# EAGLE board button-wall (EAGLE 9.4.2), part 1 of 3
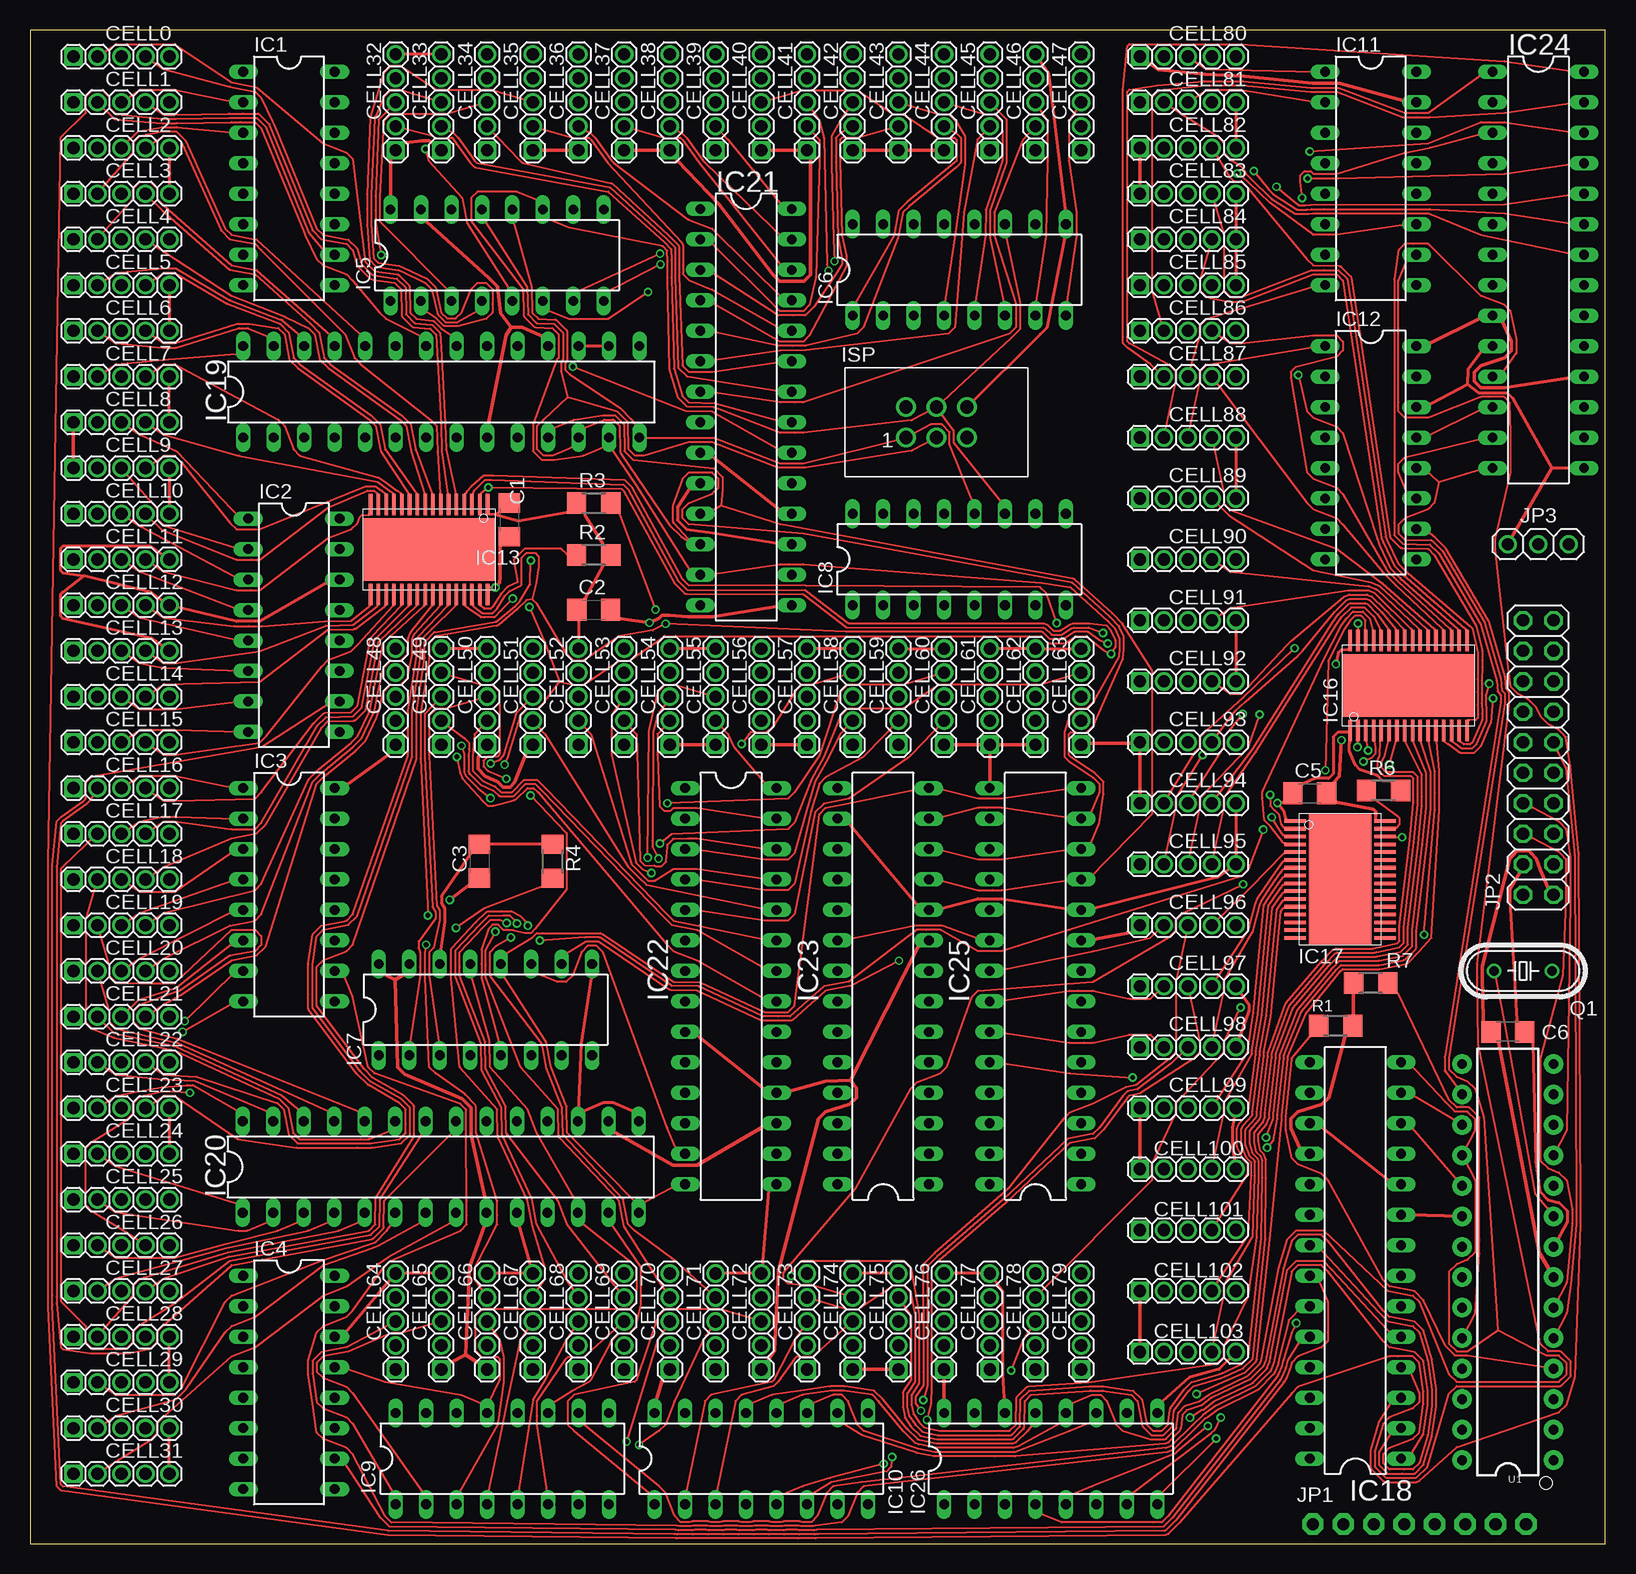
[diagram p2: board, top side]
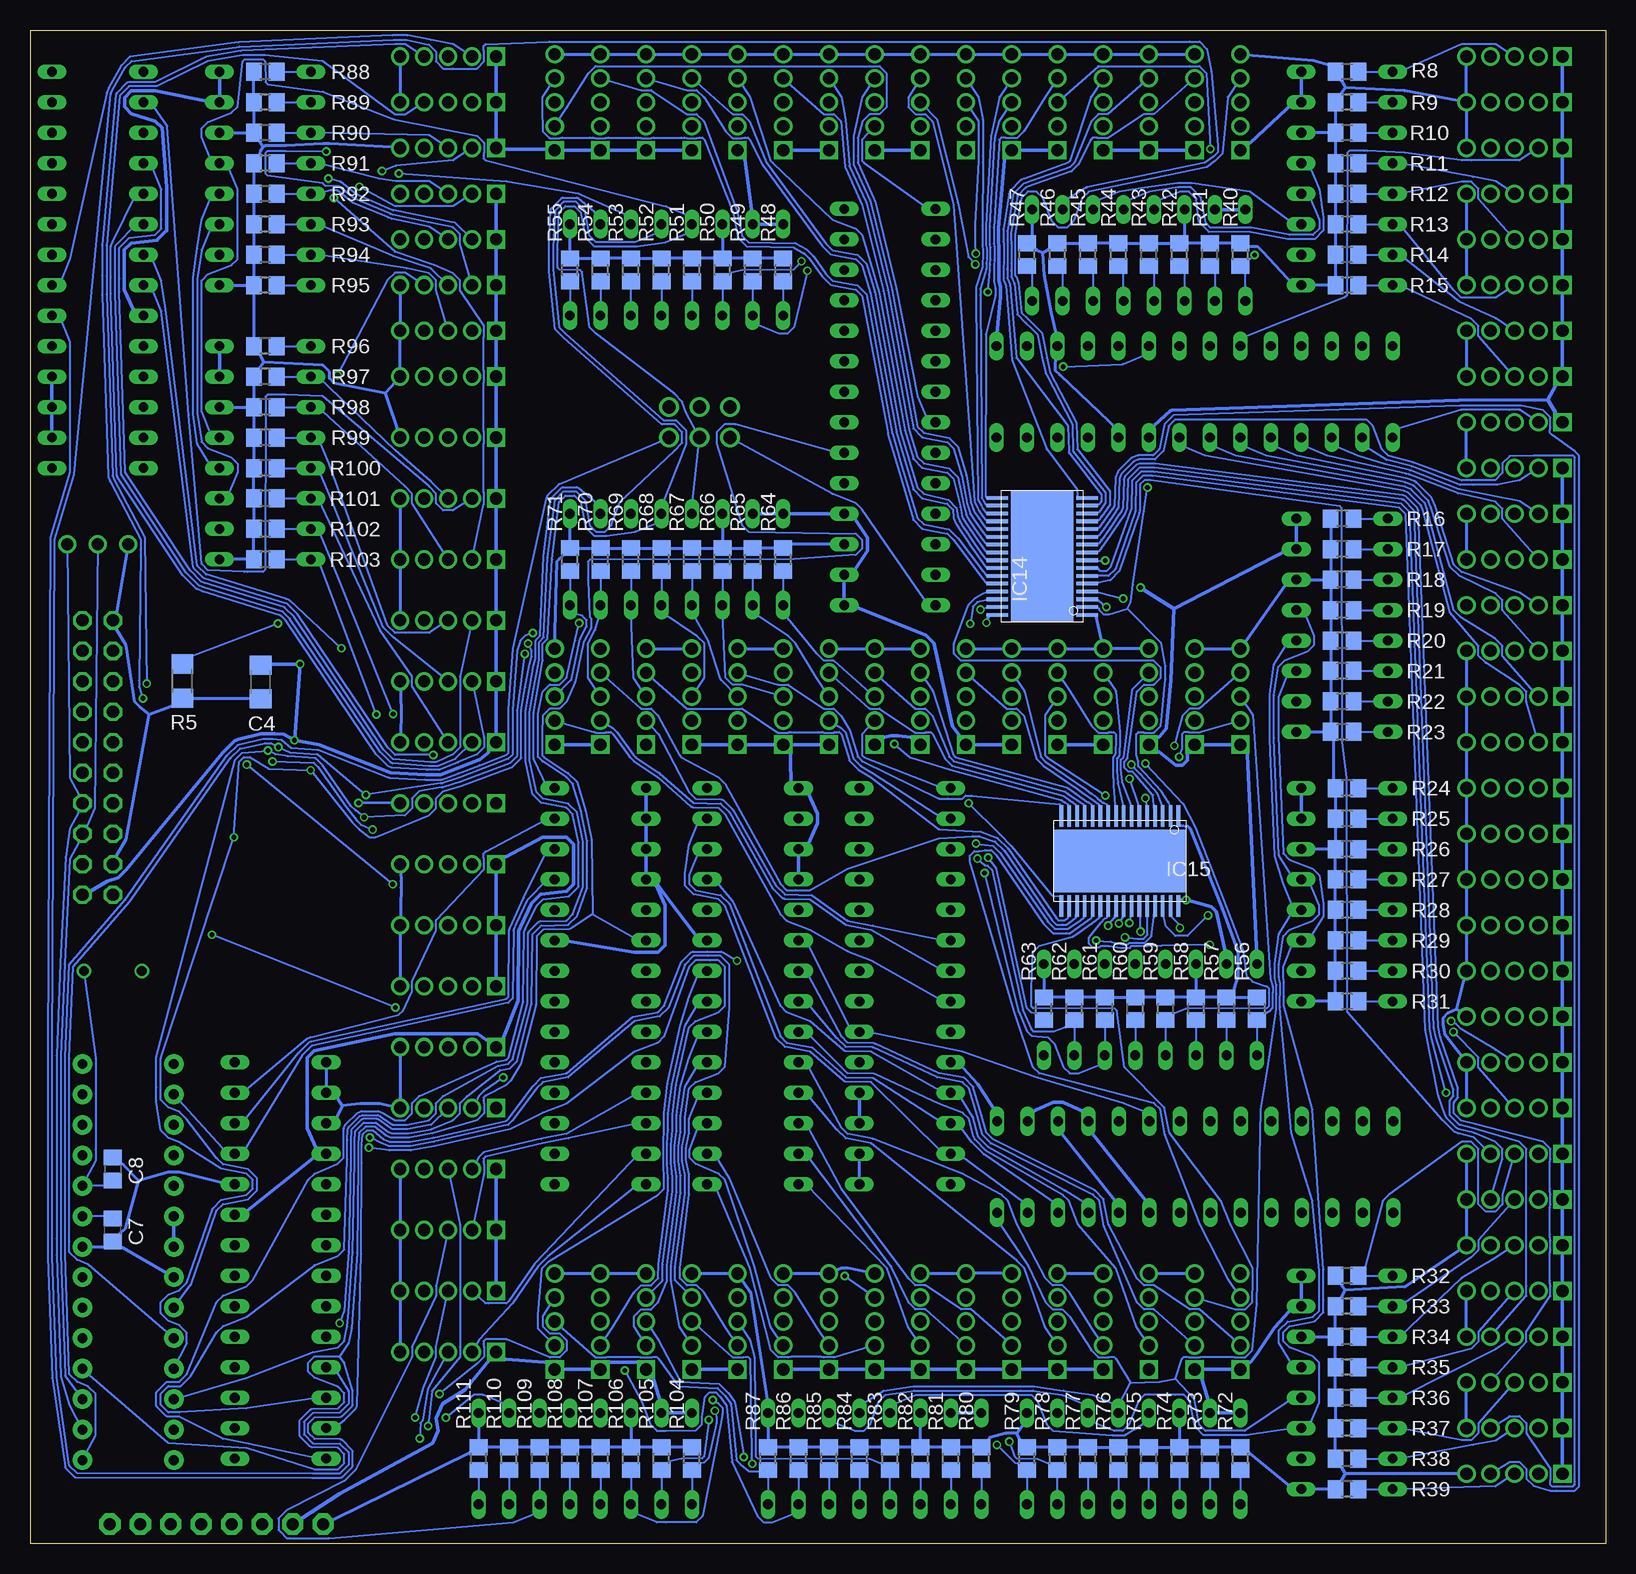
[diagram p3: board, bottom side, seen from below]

Size 131.3 x 126.16 mm. Coordinates in mm from the lower left corner, seen from the top.
Outline: 0,0 131.3,0 131.3,126.16 0,126.16 0,0
Copper layers (1*16): TOP 0.035559375mm / dielectric 1.6mm / BOTTOM 0.035559375mm
Design rules "oshpark-2layer": minimum track width 6mil, minimum drill 10mil, track to track 6mil, track to pad 6mil, pad to pad 6mil, via to via 6mil, smd to smd 6mil, copper to edge 15mil, drill to drill 6mil, minimum pad ring 5mil, minimum via ring 5mil, stop-mask expansion 2.5mil, vias tented up to drill 0mil, thermal gap 10mil
Net classes: 0 default: width 0.152 mm, clearance 0.152 mm; 1 class_VCC: width 0.254 mm, clearance 0.152 mm to class 0, clearance 0.152 mm; 2 class_GND: width 0.203 mm, clearance 0.152 mm to class 0, clearance 0.152 mm to class 1, clearance 0.152 mm

## Footprints (pad centres in the part's own frame; a part is rotated, then mirrored left to right if it is on the bottom)
C1206 = smd 1.6 x 1.8: 1 -1.4,0; 2 1.4,0
C0805 = smd 1.3 x 1.5: 1 -0.95,0; 2 0.95,0
1_05X2MM = drill 1.016 pad 1.524 square: 1 -4,0 | drill 1.016 pad 1.524: 2 -2,0; 3 0,0; 4 2,0; 5 4,0
DIL16 = drill 0.813 pad 1.219 long: 1 -8.89,-3.81; 2 -6.35,-3.81; 3 -3.81,-3.81; 4 -1.27,-3.81; 5 1.27,-3.81; 6 3.81,-3.81; 7 6.35,-3.81; 8 8.89,-3.81; 9 8.89,3.81; 10 6.35,3.81; 11 3.81,3.81; 12 1.27,3.81; 13 -1.27,3.81; 14 -3.81,3.81; 15 -6.35,3.81; 16 -8.89,3.81
HTSSOP32DAP = smd 0.3 x 1.8: 1 -4.875,-3.75; 2 -4.225,-3.75; 3 -3.575,-3.75; 4 -2.925,-3.75; 5 -2.275,-3.75; 6 -1.625,-3.75; 7 -0.975,-3.75; 8 -0.325,-3.75; 9 0.325,-3.75; 10 0.975,-3.75; 11 1.625,-3.75; 12 2.275,-3.75; 13 2.925,-3.75; 14 3.575,-3.75; 15 4.225,-3.75; 16 4.875,-3.75; 17 4.875,3.75; 18 4.225,3.75; 19 3.575,3.75; 20 2.925,3.75; 21 2.275,3.75; 22 1.625,3.75; 23 0.975,3.75; 24 0.325,3.75; 25 -0.325,3.75; 26 -0.975,3.75; 27 -1.625,3.75; 28 -2.275,3.75; 29 -2.925,3.75; 30 -3.575,3.75; 31 -4.225,3.75; 32 -4.875,3.75 | smd 11 x 5.2: EXP 0,0
DIL28-3 = drill 0.813 pad 1.219 long: 1 -16.51,-3.81; 2 -13.97,-3.81; 3 -11.43,-3.81; 4 -8.89,-3.81; 5 -6.35,-3.81; 6 -3.81,-3.81; 7 -1.27,-3.81; 8 1.27,-3.81; 9 3.81,-3.81; 10 6.35,-3.81; 11 8.89,-3.81; 12 11.43,-3.81; 13 13.97,-3.81; 14 16.51,-3.81; 15 16.51,3.81; 16 13.97,3.81; 17 11.43,3.81; 18 8.89,3.81; 19 6.35,3.81; 20 3.81,3.81; 21 1.27,3.81; 22 -1.27,3.81; 23 -3.81,3.81; 24 -6.35,3.81; 25 -8.89,3.81; 26 -11.43,3.81; 27 -13.97,3.81; 28 -16.51,3.81
61200621621 = drill 1.1 pad 1.65: 1 -2.54,-1.27; 2 -2.54,1.27; 3 0,-1.27; 4 0,1.27; 5 2.54,-1.27; 6 2.54,1.27
1X08-CLEANBIG = drill 1.016 pad 1.778 octagon: 1 -8.89,0; 2 -6.35,0; 3 -3.81,0; 4 -1.27,0; 5 1.27,0; 6 3.81,0; 7 6.35,0; 8 8.89,0
2X10 = drill 1.016 pad 1.524 octagon: 1 -11.43,-1.27; 2 -11.43,1.27; 3 -8.89,-1.27; 4 -8.89,1.27; 5 -6.35,-1.27; 6 -6.35,1.27; 7 -3.81,-1.27; 8 -3.81,1.27; 9 -1.27,-1.27; 10 -1.27,1.27; 11 1.27,-1.27; 12 1.27,1.27; 13 3.81,-1.27; 14 3.81,1.27; 15 6.35,-1.27; 16 6.35,1.27; 17 8.89,-1.27; 18 8.89,1.27; 19 11.43,-1.27; 20 11.43,1.27
1X03 = drill 1.016 pad 1.524: 1 -2.54,0; 2 0,0; 3 2.54,0
HC49/S = drill 0.813 pad 1.219: 1 -2.413,0; 2 2.413,0
R1206 = smd 1.6 x 1.803: 1 -1.422,0; 2 1.422,0
R0805 = smd 1.3 x 1.5: 1 -0.95,0; 2 0.95,0
DIP28 = drill 0.813 pad 1.626: 1 -16.51,-3.81; 2 -13.97,-3.81; 3 -11.43,-3.81; 4 -8.89,-3.81; 5 -6.35,-3.81; 6 -3.81,-3.81; 7 -1.27,-3.81; 8 1.27,-3.81; 9 3.81,-3.81; 10 6.35,-3.81; 11 8.89,-3.81; 12 11.43,-3.81; 13 13.97,-3.81; 14 16.51,-3.81; 15 16.51,3.81; 16 13.97,3.81; 17 11.43,3.81; 18 8.89,3.81; 19 6.35,3.81; 20 3.81,3.81; 21 1.27,3.81; 22 -1.27,3.81; 23 -3.81,3.81; 24 -6.35,3.81; 25 -8.89,3.81; 26 -11.43,3.81; 27 -13.97,3.81; 28 -16.51,3.81

## Placement (x,y rotation side)
C1  [C1206]  39.95,85.34 270 top
C2  [C1206]  46.99,77.85 0 top
C3  [C1206]  37.46,56.9 270 top
C4  [C1206]  112.14,71.83 90 bottom
C5  [C1206]  106.68,62.56 0 top
C6  [C1206]  123.19,42.67 180 top
C7  16pF  [C0805]  124.46,26.16 90 bottom
C8  16pF  [C0805]  124.46,31.24 270 bottom
CELL0  [1_05X2MM]  7.62,123.95 0 top
CELL1  [1_05X2MM]  7.62,120.14 0 top
CELL2  [1_05X2MM]  7.62,116.33 0 top
CELL3  [1_05X2MM]  7.62,112.52 0 top
CELL4  [1_05X2MM]  7.62,108.71 0 top
CELL5  [1_05X2MM]  7.62,104.9 0 top
CELL6  [1_05X2MM]  7.62,101.09 0 top
CELL7  [1_05X2MM]  7.62,97.28 0 top
CELL8  [1_05X2MM]  7.62,93.47 0 top
CELL9  [1_05X2MM]  7.62,89.66 0 top
CELL10  [1_05X2MM]  7.62,85.85 0 top
CELL11  [1_05X2MM]  7.62,82.04 0 top
CELL12  [1_05X2MM]  7.62,78.23 0 top
CELL13  [1_05X2MM]  7.62,74.42 0 top
CELL14  [1_05X2MM]  7.62,70.61 0 top
CELL15  [1_05X2MM]  7.62,66.8 0 top
CELL16  [1_05X2MM]  7.62,62.99 0 top
CELL17  [1_05X2MM]  7.62,59.18 0 top
CELL18  [1_05X2MM]  7.62,55.37 0 top
CELL19  [1_05X2MM]  7.62,51.56 0 top
CELL20  [1_05X2MM]  7.62,47.75 0 top
CELL21  [1_05X2MM]  7.62,43.94 0 top
CELL22  [1_05X2MM]  7.62,40.13 0 top
CELL23  [1_05X2MM]  7.62,36.32 0 top
CELL24  [1_05X2MM]  7.62,32.51 0 top
CELL25  [1_05X2MM]  7.62,28.7 0 top
CELL26  [1_05X2MM]  7.62,24.89 0 top
CELL27  [1_05X2MM]  7.62,21.08 0 top
CELL28  [1_05X2MM]  7.62,17.27 0 top
CELL29  [1_05X2MM]  7.62,13.46 0 top
CELL30  [1_05X2MM]  7.62,9.65 0 top
CELL31  [1_05X2MM]  7.62,5.84 0 top
CELL32  [1_05X2MM]  30.48,120.14 90 top
CELL33  [1_05X2MM]  34.29,120.14 90 top
CELL34  [1_05X2MM]  38.1,120.14 90 top
CELL35  [1_05X2MM]  41.91,120.14 90 top
CELL36  [1_05X2MM]  45.72,120.14 90 top
CELL37  [1_05X2MM]  49.53,120.14 90 top
CELL38  [1_05X2MM]  53.34,120.14 90 top
CELL39  [1_05X2MM]  57.15,120.14 90 top
CELL40  [1_05X2MM]  60.96,120.14 90 top
CELL41  [1_05X2MM]  64.77,120.14 90 top
CELL42  [1_05X2MM]  68.58,120.14 90 top
CELL43  [1_05X2MM]  72.39,120.14 90 top
CELL44  [1_05X2MM]  76.2,120.14 90 top
CELL45  [1_05X2MM]  80.01,120.14 90 top
CELL46  [1_05X2MM]  83.82,120.14 90 top
CELL47  [1_05X2MM]  87.63,120.14 90 top
CELL48  [1_05X2MM]  30.48,70.61 90 top
CELL49  [1_05X2MM]  34.29,70.61 90 top
CELL50  [1_05X2MM]  38.1,70.61 90 top
CELL51  [1_05X2MM]  41.91,70.61 90 top
CELL52  [1_05X2MM]  45.72,70.61 90 top
CELL53  [1_05X2MM]  49.53,70.61 90 top
CELL54  [1_05X2MM]  53.34,70.61 90 top
CELL55  [1_05X2MM]  57.15,70.61 90 top
CELL56  [1_05X2MM]  60.96,70.61 90 top
CELL57  [1_05X2MM]  64.77,70.61 90 top
CELL58  [1_05X2MM]  68.58,70.61 90 top
CELL59  [1_05X2MM]  72.39,70.61 90 top
CELL60  [1_05X2MM]  76.2,70.61 90 top
CELL61  [1_05X2MM]  80.01,70.61 90 top
CELL62  [1_05X2MM]  83.82,70.61 90 top
CELL63  [1_05X2MM]  87.63,70.61 90 top
CELL64  [1_05X2MM]  30.48,18.54 90 top
CELL65  [1_05X2MM]  34.29,18.54 90 top
CELL66  [1_05X2MM]  38.1,18.54 90 top
CELL67  [1_05X2MM]  41.91,18.54 90 top
CELL68  [1_05X2MM]  45.72,18.54 90 top
CELL69  [1_05X2MM]  49.53,18.54 90 top
CELL70  [1_05X2MM]  53.34,18.54 90 top
CELL71  [1_05X2MM]  57.15,18.54 90 top
CELL72  [1_05X2MM]  60.96,18.54 90 top
CELL73  [1_05X2MM]  64.77,18.54 90 top
CELL74  [1_05X2MM]  68.58,18.54 90 top
CELL75  [1_05X2MM]  72.39,18.54 90 top
CELL76  [1_05X2MM]  76.2,18.54 90 top
CELL77  [1_05X2MM]  80.01,18.54 90 top
CELL78  [1_05X2MM]  83.82,18.54 90 top
CELL79  [1_05X2MM]  87.63,18.54 90 top
CELL80  [1_05X2MM]  96.52,123.95 0 top
CELL81  [1_05X2MM]  96.52,120.14 0 top
CELL82  [1_05X2MM]  96.52,116.33 0 top
CELL83  [1_05X2MM]  96.52,112.52 0 top
CELL84  [1_05X2MM]  96.52,108.71 0 top
CELL85  [1_05X2MM]  96.52,104.9 0 top
CELL86  [1_05X2MM]  96.52,101.09 0 top
CELL87  [1_05X2MM]  96.52,97.28 0 top
CELL88  [1_05X2MM]  96.52,92.2 0 top
CELL89  [1_05X2MM]  96.52,87.12 0 top
CELL90  [1_05X2MM]  96.52,82.04 0 top
CELL91  [1_05X2MM]  96.52,76.96 0 top
CELL92  [1_05X2MM]  96.52,71.88 0 top
CELL93  [1_05X2MM]  96.52,66.8 0 top
CELL94  [1_05X2MM]  96.52,61.72 0 top
CELL95  [1_05X2MM]  96.52,56.64 0 top
CELL96  [1_05X2MM]  96.52,51.56 0 top
CELL97  [1_05X2MM]  96.52,46.48 0 top
CELL98  [1_05X2MM]  96.52,41.4 0 top
CELL99  [1_05X2MM]  96.52,36.32 0 top
CELL100  [1_05X2MM]  96.52,31.24 0 top
CELL101  [1_05X2MM]  96.52,26.16 0 top
CELL102  [1_05X2MM]  96.52,21.08 0 top
CELL103  [1_05X2MM]  96.52,16 0 top
IC1  MCP3008  [DIL16]  21.59,113.79 270 top
IC2  MCP3008  [DIL16]  22,76.56 270 top
IC3  MCP3008  [DIL16]  21.59,54.1 270 top
IC4  MCP3008  [DIL16]  21.59,13.46 270 top
IC5  MCP3008  [DIL16]  38.94,107.39 0 top
IC6  MCP3008  [DIL16]  77.47,106.17 0 top
IC7  MCP3008  [DIL16]  37.97,44.53 0 top
IC8  MCP3008  [DIL16]  77.47,82.04 0 top
IC9  MCP3008  [DIL16]  39.37,7.11 0 top
IC10  MCP3008  [DIL16]  60.96,7.11 0 top
IC11  MCP3008  [DIL16]  111.76,113.79 270 top
IC12  MCP3008  [DIL16]  111.76,90.93 270 top
IC13  [HTSSOP32DAP]  33.27,82.85 180 top
IC14  TLC5947-DAP  [HTSSOP32DAP]  46.99,82.3 90 bottom
IC15  TLC5947-DAP  [HTSSOP32DAP]  40.51,56.9 180 bottom
IC16  [HTSSOP32DAP]  114.91,71.55 0 top
IC17  [HTSSOP32DAP]  109.22,55.37 270 top
IC18  MCP23S17SP  [DIL28-3]  110.49,23.62 90 top
IC19  MCP23S17SP  [DIL28-3]  34.29,96.01 0 top
IC20  MCP23S17SP  [DIL28-3]  34.24,31.42 0 top
IC21  MCP23S17SP  [DIL28-3]  59.69,94.74 270 top
IC22  MCP23S17SP  [DIL28-3]  58.42,46.48 270 top
IC23  MCP23S17SP  [DIL28-3]  71.12,46.48 90 top
IC24  MCP23S17SP  [DIL28-3]  125.73,106.17 270 top
IC25  MCP23S17SP  [DIL28-3]  83.82,46.48 90 top
IC26  MCP3008  [DIL16]  85.09,7.11 0 top
ISP  [61200621621]  75.57,93.47 0 top
JP1  [1X08-CLEANBIG]  115.82,1.65 0 top
JP2  [2X10]  125.73,65.53 90 top
JP3  [1X03]  125.73,83.31 180 top
Q1  16 MHz  [HC49/S]  124.46,47.75 180 top
R1  [R1206]  108.84,43.18 0 top
R2  [R1206]  46.99,82.42 0 top
R3  [R1206]  46.99,86.74 180 top
R4  [R1206]  43.56,56.9 90 top
R5  [R1206]  118.67,71.91 270 bottom
R6  [R1206]  112.83,62.79 0 top
R7  [R1206]  111.76,46.74 0 top
R8  [R0805]  21.59,122.68 180 bottom
R9  10K  [R0805]  21.59,120.14 180 bottom
R10  10K  [R0805]  21.59,117.6 180 bottom
R11  10K  [R0805]  21.59,115.06 180 bottom
R12  10K  [R0805]  21.59,112.52 180 bottom
R13  10K  [R0805]  21.59,109.98 180 bottom
R14  10K  [R0805]  21.59,107.44 180 bottom
R15  10K  [R0805]  21.59,104.9 180 bottom
R16  10K  [R0805]  22,85.45 180 bottom
R17  10K  [R0805]  22,82.91 180 bottom
R18  10K  [R0805]  22,80.37 180 bottom
R19  10K  [R0805]  22,77.83 180 bottom
R20  10K  [R0805]  22,75.29 180 bottom
R21  10K  [R0805]  22,72.75 180 bottom
R22  10K  [R0805]  22,70.21 180 bottom
R23  10K  [R0805]  22,67.67 180 bottom
R24  10K  [R0805]  21.59,62.99 180 bottom
R25  10K  [R0805]  21.59,60.45 180 bottom
R26  10K  [R0805]  21.59,57.91 180 bottom
R27  10K  [R0805]  21.59,55.37 180 bottom
R28  10K  [R0805]  21.59,52.83 180 bottom
R29  10K  [R0805]  21.59,50.29 180 bottom
R30  10K  [R0805]  21.59,47.75 180 bottom
R31  10K  [R0805]  21.59,45.21 180 bottom
R32  10K  [R0805]  21.59,22.35 180 bottom
R33  10K  [R0805]  21.59,19.81 180 bottom
R34  10K  [R0805]  21.59,17.27 180 bottom
R35  10K  [R0805]  21.59,14.73 180 bottom
R36  10K  [R0805]  21.59,12.19 180 bottom
R37  10K  [R0805]  21.59,9.65 180 bottom
R38  10K  [R0805]  21.59,7.11 180 bottom
R39  10K  [R0805]  21.59,4.57 180 bottom
R40  10K  [R0805]  30.48,107.44 90 bottom
R41  10K  [R0805]  33.02,107.44 90 bottom
R42  10K  [R0805]  35.56,107.44 90 bottom
R43  10K  [R0805]  38.1,107.44 90 bottom
R44  10K  [R0805]  40.64,107.44 90 bottom
R45  10K  [R0805]  43.18,107.44 90 bottom
R46  10K  [R0805]  45.72,107.44 90 bottom
R47  10K  [R0805]  48.26,107.44 90 bottom
R48  10K  [R0805]  68.58,106.17 90 bottom
R49  10K  [R0805]  71.12,106.17 90 bottom
R50  10K  [R0805]  73.66,106.17 90 bottom
R51  10K  [R0805]  76.2,106.17 90 bottom
R52  10K  [R0805]  78.74,106.17 90 bottom
R53  10K  [R0805]  81.28,106.17 90 bottom
R54  10K  [R0805]  83.82,106.17 90 bottom
R55  10K  [R0805]  86.36,106.17 90 bottom
R56  10K  [R0805]  29.08,44.6 90 bottom
R57  10K  [R0805]  31.62,44.6 90 bottom
R58  10K  [R0805]  34.16,44.6 90 bottom
R59  10K  [R0805]  36.7,44.6 90 bottom
R60  10K  [R0805]  39.24,44.6 90 bottom
R61  10K  [R0805]  41.78,44.6 90 bottom
R62  10K  [R0805]  44.32,44.6 90 bottom
R63  10K  [R0805]  46.86,44.6 90 bottom
R64  10K  [R0805]  68.58,82.04 90 bottom
R65  10K  [R0805]  71.12,82.04 90 bottom
R66  10K  [R0805]  73.66,82.04 90 bottom
R67  10K  [R0805]  76.2,82.04 90 bottom
R68  10K  [R0805]  78.74,82.04 90 bottom
R69  10K  [R0805]  81.28,82.04 90 bottom
R70  10K  [R0805]  83.82,82.04 90 bottom
R71  10K  [R0805]  86.36,82.04 90 bottom
R72  10K  [R0805]  30.48,7.11 90 bottom
R73  10K  [R0805]  33.02,7.11 90 bottom
R74  10K  [R0805]  35.56,7.11 90 bottom
R75  10K  [R0805]  38.1,7.11 90 bottom
R76  10K  [R0805]  40.64,7.11 90 bottom
R77  10K  [R0805]  43.18,7.11 90 bottom
R78  10K  [R0805]  45.72,7.11 90 bottom
R79  10K  [R0805]  48.26,7.11 90 bottom
R80  10K  [R0805]  52.07,7.11 90 bottom
R81  10K  [R0805]  54.61,7.11 90 bottom
R82  10K  [R0805]  57.15,7.11 90 bottom
R83  10K  [R0805]  59.69,7.11 90 bottom
R84  10K  [R0805]  62.23,7.11 90 bottom
R85  10K  [R0805]  64.77,7.11 90 bottom
R86  10K  [R0805]  67.31,7.11 90 bottom
R87  10K  [R0805]  69.85,7.11 90 bottom
R88  10K  [R0805]  111.76,122.68 180 bottom
R89  10K  [R0805]  111.76,120.14 180 bottom
R90  10K  [R0805]  111.76,117.6 180 bottom
R91  10K  [R0805]  111.76,115.06 180 bottom
R92  10K  [R0805]  111.76,112.52 180 bottom
R93  10K  [R0805]  111.76,109.98 180 bottom
R94  10K  [R0805]  111.76,107.44 180 bottom
R95  10K  [R0805]  111.76,104.9 180 bottom
R96  10K  [R0805]  111.76,99.82 180 bottom
R97  10K  [R0805]  111.76,97.28 180 bottom
R98  10K  [R0805]  111.76,94.74 180 bottom
R99  10K  [R0805]  111.76,92.2 180 bottom
R100  [R0805]  111.76,89.66 180 bottom
R101  [R0805]  111.76,87.12 180 bottom
R102  [R0805]  111.76,84.58 180 bottom
R103  [R0805]  111.76,82.04 180 bottom
R104  [R0805]  76.2,7.11 90 bottom
R105  [R0805]  78.74,7.11 90 bottom
R106  [R0805]  81.28,7.11 90 bottom
R107  [R0805]  83.82,7.11 90 bottom
R108  10K  [R0805]  86.36,7.11 90 bottom
R109  10K  [R0805]  88.9,7.11 90 bottom
R110  10K  [R0805]  91.44,7.11 90 bottom
R111  10K  [R0805]  93.98,7.11 90 bottom
U1  328P  [DIP28]  123.19,23.49 90 top

## Tracks (layer width: path | path; a pad name or v marks a point on that pad's centre or on a via)
ADC_CS0
  TOP 0.152: IC18.21 107.29,24.89 112.45,19.3 113.18,18.57 115.28,18.16 115.8,17.64 116.51,15.33 116.87,12.86 116.87,11.53 116.51,9.06 115.8,6.74 115.28,6.22 114.54,6.22 113.32,6.22 112.8,6.74 112.8,7.48 113.32,8 115.28,8.76 115.8,9.28 116.15,11.68 116.15,12.71 115.8,15.1 115.28,15.62 114.06,15.62 113.32,15.62 105.7,13.08 105.18,12.56 95.83,1.78 94.9,0.84 94.65,0.74 65.49,0.46 64.05,0.46 53.89,0.46 29.81,0.74 2.6,4.45 2.22,4.82 1.51,19.78 1.51,20.86 1.51,56.68 2.58,117.21 2.74,117.37 4.5,119.1 4.66,119.26 4.66,119.5 4.65,119.65 4.62,119.73 4.62,120.56 5.21,121.14 6.03,121.14 6.62,120.56 6.62,119.73 7.21,119.14 11.07,118.76 12.17,118.76 16.66,118.85 17.69,118.85 18.9,118.85 19.63,118.12 23.19,109.39 23.24,109.27 24.79,107.44 IC1.10
ADC_CS1
  TOP 0.152: IC18.22 107.29,22.35 108.18,20.18 108.18,17.64 108.18,16.9 107.66,16.38 105.7,15.62 105.18,15.1 105.02,14.57 104.71,13.83 104.5,13.48 95.53,1.98 94.69,1.14 94.57,1.09 65.7,0.81 65.42,0.8 64.12,0.8 63.84,0.81 63.16,0.81 62.88,0.8 61.58,0.8 61.3,0.81 60.62,0.81 60.34,0.8 59.04,0.8 58.76,0.81 58.08,0.81 57.8,0.8 56.5,0.8 56.22,0.81 55.54,0.81 55.26,0.8 53.96,0.8 53.68,0.81 29.89,1.09 2.74,4.8 2.58,4.96 1.87,19.91 1.87,20.73 1.87,56.54 2.22,60.21 2.6,60.58 4.5,61.95 4.66,62.11 4.66,62.35 4.65,62.49 4.62,62.58 4.62,63.41 5.21,63.99 19.31,66.42 25.2,70.21 IC2.10
ADC_CS2
  TOP 0.152: IC18.23 106.07,19.81 104.92,18.66 104.12,15.4 104.05,15.1 104,14.91 103.76,14.31 103.65,14.14 102.38,12.87 102.21,12.77 99,11.17 98.2,10.57 97.94,10.44 97.09,9.59 95.31,7.86 95.28,7.85 94.8,7.65 94.78,7.64 69.48,4.8 68.96,4.28 68.2,2.32 67.68,1.8 65.46,1.52 65.27,1.48 64.27,1.48 64.08,1.52 62.92,1.52 62.73,1.48 61.73,1.48 61.54,1.52 60.38,1.52 60.19,1.48 59.19,1.48 59,1.52 57.84,1.52 57.65,1.48 56.65,1.48 56.46,1.52 55.3,1.52 55.11,1.48 54.11,1.48 53.92,1.52 30.11,1.8 29.59,2.32 26.9,7.48 26.38,8 24.42,8.76 23.9,9.28 23.55,11.68 23.19,14.14 23.19,15.33 23.9,17.64 24.42,18.16 26.38,18.92 26.9,19.44 29.44,22.97 30.05,23.58 35.88,26.11 36.4,26.63 36.4,27.37 36.4,28.59 36.37,34.01 36.37,36.2 35.87,36.7 28.71,39.22 28.19,39.74 26.9,45.58 26.01,47.75 IC3.10
ADC_CS3
  TOP 0.152: IC18.24 106.07,17.27 104.83,15.25 104.68,14.68 104.39,13.99 104.22,13.7 95.23,2.18 94.5,1.45 65.56,1.17 65.36,1.14 64.19,1.14 63.98,1.17 63.02,1.17 62.81,1.14 61.64,1.14 61.44,1.17 60.48,1.17 60.27,1.14 59.1,1.14 58.9,1.17 57.94,1.17 57.73,1.14 56.56,1.14 56.36,1.17 55.4,1.17 55.2,1.14 54.02,1.14 53.82,1.17 29.96,1.45 29.23,2.18 26.01,7.11 IC4.10
ADC_CS4
  BOTTOM 0.152: IC18.25 106.07,14.73 104.83,12.71 104.83,11.68 105.56,10.95 107.81,10.9 108.53,10.17 108.53,9.14 107.81,8.41 105.56,8.36 104.83,7.63 104.83,6.6 105.56,5.87 106.77,5.87 107.81,5.87 127.45,5.89 128.09,6.53 129.16,13.9 129.51,23.99 129.51,25.54 129.51,40.78 129.31,83.74 127.69,89.15 124.64,120.84 124.51,121.14 123.42,123.05 122.9,123.57 113.9,124.78 101.07,125.35 99.97,125.35 98.11,124.95 97.52,124.37 97.52,123.54 96.93,122.95 96.11,122.95 94.11,122.95 93.52,123.54 93.52,124.37 93.55,124.45 93.56,124.6 93.56,124.83 93.4,124.99 88.06,125.18 34.72,125.18 33.86,125.18 33.25,124.57 32.89,122.7 32.34,116.5 32.34,115.98 32.71,115.61 33.41,115.1 43.26,113.06 45.29,111.81 IC5.10
ADC_CS5
  BOTTOM 0.152: IC18.26 107.29,12.19 113.32,11.3 118.93,10.97 119.83,10.97 120.47,11.61 120.47,12.52 119.83,13.16 118.82,13.16 118.75,13.18 117.96,13.98 115.8,17.64 115.28,18.16 113.32,18.92 107.66,23.24 105.7,24 105.18,24.52 104.93,32.04 104.93,33.66 104.9,34.52 104.81,34.74 103.9,35.65 103.68,35.74 102.38,35.74 102.16,35.65 101.12,34.94 101.07,34.92 99.97,34.92 98.11,35.32 97.52,35.91 97.52,36.74 96.93,37.32 92.33,39.85 91.5,40 91.12,40.38 89.9,45.08 89.84,50.89 89.79,51.01 88.95,51.84 88.83,51.89 86.65,51.94 86.13,52.46 85.27,54.75 85.27,56 85.27,58.54 85.78,60.97 86.51,61.7 88.61,62.1 89.13,62.62 89.72,65.31 89.72,66.39 89.72,69.3 89.38,71.24 89.03,73.17 88.93,73.68 88.93,75.15 88.93,75.16 88.55,75.55 88.2,82.19 87.61,86.98 86.88,87.71 85.85,87.71 85.12,86.98 84.71,84.87 84.19,84.35 83.45,84.35 82.93,84.87 82.17,86.83 81.65,87.35 77.65,91.11 77.01,91.75 77.01,92.66 77.65,93.3 78.67,93.3 78.73,93.32 86.88,100.51 87.61,101.24 88.1,106.06 88.1,106.88 88.1,108.18 87.96,111.19 87.91,111.31 87.07,112.14 86.95,112.19 85.77,112.19 85.65,112.14 83.82,110.59 IC6.10
ADC_CS6  (via drill 0.4 pad 0.7)
  TOP 0.152: v72.44,48.6 68.44,46.51 66.33,46.1 63.55,43.66 63.43,43.61 62.25,43.61 61.03,43.61 60.91,43.66 55.59,46.1 53.41,46.15 53.29,46.2 47.38,50.19 46.35,50.19 44.32,48.95 IC7.10
  BOTTOM 0.152: IC18.27 106.07,9.65 105.16,10.34 104.22,11.28 104.12,11.53 103.76,24.16 103.7,31.77 103.7,33.26 103.62,34.12 103.27,34.47 102.78,34.47 101.94,33.75 101.89,33.72 101.39,33.52 101.34,33.5 99.7,33.5 97.75,33.86 91.64,35.28 91.48,35.44 89.48,38.11 88.76,38.84 86.65,39.24 81.14,43.92 79.03,44.32 78.51,44.84 77.14,48.35 77.09,48.47 76.25,49.3 76.13,49.35 74.91,49.35 73.73,49.35 73.61,49.3 v72.44,48.6
ADC_CS7
  BOTTOM 0.152: IC18.28 107.29,7.11 113.18,8.36 115.28,8.76 118.93,10.62 119.94,10.62 120.01,10.64 120.8,11.44 120.83,11.5 120.83,12.63 120.8,12.69 120.01,13.49 119.94,13.51 118.93,13.51 118.29,14.15 115.8,20.18 115.28,20.7 113.32,21.46 112.8,21.98 108.18,30.34 107.66,30.86 105.72,31.67 105.23,32.16 105.23,33.72 105.22,34.59 105.08,34.92 104.08,35.92 103.74,36.06 102.32,36.06 101.98,35.92 100.93,35.32 100.11,35.32 99.52,35.91 99.52,36.74 98.93,37.32 92.49,40.19 92.47,40.2 91.64,40.36 91.48,40.52 90.26,45.15 90.2,50.96 90.09,51.21 89.13,53.2 88.61,53.72 86.47,53.97 86.42,53.99 85.64,54.77 85.62,54.82 85.62,55.93 85.62,58.46 86.13,60.82 86.65,61.34 88.76,61.75 89.48,62.48 90.08,65.24 90.08,66.46 90.08,69.37 89.74,71.31 89.38,73.24 89.23,73.81 89.23,75.21 89.18,75.33 88.86,75.67 88.56,82.31 87.96,87.06 87.91,87.18 87.07,88.01 86.95,88.06 85.77,88.06 85.65,88.01 83.82,86.46 IC8.10
ADC_CS8
  TOP 0.152: IC18.1 114.91,7.11 116.15,9.14 116.51,11.6 116.51,12.79 116.15,15.25 115.43,15.98 113.32,16.38 112.8,16.9 108.18,22.72 107.66,23.24 106.44,23.24 105.7,23.24 105.18,22.72 103.7,15.14 103.66,15.02 103.44,14.47 103.37,14.36 102.16,13.15 102.05,13.09 98.86,11.53 98,10.87 97.8,10.77 96.95,9.92 95.1,8.16 94.72,8 69.33,5.16 66.94,4.8 66.42,4.28 65.64,2.33 65.13,1.82 64.41,1.82 64.15,1.88 62.85,1.88 62.59,1.82 61.87,1.82 61.61,1.88 60.31,1.88 60.05,1.82 59.33,1.82 59.07,1.88 57.77,1.88 57.51,1.82 56.79,1.82 56.53,1.88 55.23,1.88 54.97,1.82 54.25,1.82 53.74,2.33 52.96,4.28 52.44,4.8 45.72,10.31 IC9.10
ADC_CS9
  TOP 0.152: IC18.2 113.69,9.65 112.45,7.63 112.45,6.6 113.18,5.87 114.39,5.87 115.43,5.87 116.15,6.6 116.87,8.99 117.22,11.46 117.22,12.93 116.87,15.4 116.15,17.79 115.43,18.52 113.32,18.92 112.8,19.44 108.18,25.26 107.66,25.78 106.44,25.78 105.7,25.78 105.18,25.26 104.47,22.95 103.05,15.57 102.98,15.24 102.8,14.8 101.72,13.72 98.5,12.17 97.64,11.52 97.57,11.52 96.44,11.15 96.07,10.79 95.94,9.65 95.83,9.4 94.9,8.46 94.65,8.36 82.12,7.29 80.44,7.29 75.36,7.29 73.97,7.58 73.93,7.59 69.33,9.07 67.31,10.31 IC10.10
ADC_CS10
  TOP 0.152: IC18.3 113.69,12.19 112.45,10.17 111.73,7.78 111.73,6.45 111.84,6.2 112.77,5.26 113.03,5.16 114.25,5.16 115.57,5.16 115.83,5.26 118.93,8.08 127.45,10.97 128.09,11.61 128.8,13.97 129.26,26.58 129.26,28.03 129.11,57.5 128.4,64.84 128.04,67.23 127.6,67.68 127.43,67.84 126.57,68.3 126.41,68.46 125.96,68.91 125.5,69.77 125.06,70.22 124.89,70.38 124.03,70.84 123.87,71 123.42,71.45 123.33,72.3 122.15,82.88 122.15,83.74 123.42,89.29 123.42,90.03 123.42,92.57 123.37,95.09 122.88,95.58 121.66,95.58 120.96,95.58 116.55,93.85 115.81,93.85 114.59,93.85 114.07,94.37 114.07,95.11 114.07,105.27 114.96,107.44 IC11.10
ADC_CS11
  TOP 0.152: IC18.4 114.91,14.73 115.8,12.56 115.8,11.82 115.28,11.3 113.32,10.54 112.8,10.02 112.09,7.71 112.09,6.52 112.14,6.4 112.98,5.56 113.1,5.51 114.32,5.51 115.5,5.51 115.62,5.56 116.46,6.4 116.51,6.52 117.22,8.92 118.29,12.52 118.93,13.16 127.56,13.16 127.63,13.18 128.42,13.98 128.45,14.04 128.45,15.17 128.42,15.23 127.63,16.03 127.56,16.05 126.55,16.05 125.91,16.69 120.71,41.66 120.65,47.2 120.65,48.3 123.3,69.92 123.3,71 123.29,71.03 123.06,71.3 122.98,72.23 121.64,76.82 121.57,76.97 118.03,82.96 117.1,83.89 116.18,84.58 IC12.10
ADC_CS12  (via drill 0.4 pad 0.7)
  TOP 0.152: v96.7,10.53 97.62,11.15 97.65,11.16 97.78,11.16 97.8,11.17 98.7,11.87 101.89,13.4 101.94,13.43 103.09,14.58 103.12,14.63 103.33,15.13 103.34,15.18 103.4,15.53 104.83,22.87 105.56,23.6 106.59,23.6 107.81,23.6 108.53,22.87 113.69,17.27 IC18.5
  BOTTOM 0.152: IC26.10 91.44,11.53 93.61,12.42 94.35,12.42 v96.7,10.53
AUX0
  TOP 0.152: JP2.11 127.32,66.12 127.32,66.04 128.04,64.69 128.75,57.37 128.91,27.96 128.91,26.65 128.45,21.66 128.09,19.23 U1.5
BTN00
  TOP 0.152: CELL0.2 7.19,124.99 8.05,124.99 12.05,124.99 16.8,121.79 18.9,121.39 24.42,116.71 26.38,115.95 26.9,115.43 27.94,106.86 27.95,106.84 28.71,106.08 28.74,106.06 30.64,105.79 30.76,105.74 31.6,104.91 31.65,104.78 31.7,102.6 32.22,102.08 33.59,101.91 33.67,101.88 34.3,101.25 35.56,100.43 IC19.21
BTN01
  TOP 0.152: CELL1.2 7.02,118.76 7.07,118.75 11,118.41 12.24,118.41 16.8,118.49 17.54,118.49 18.76,118.49 19.28,117.97 22.84,109.32 22.94,109.07 23.9,107.07 24.42,106.55 26.38,105.79 26.9,105.27 29.16,102.6 29.68,102.08 33.02,100.43 IC19.22
BTN02
  BOTTOM 0.152: CELL2.2 7.19,115.29 11.19,115.29 12.05,115.29 16.8,115.95 19.87,116.09 20.11,116.09 21.41,116.09 21.57,115.93 21.61,104.04 21.77,103.87 28.31,101.32 30.48,100.43 IC19.23
BTN03
  TOP 0.152: CELL3.2 8.62,115.92 8.62,116.75 9.21,117.33 11.07,117.71 12.17,117.71 12.21,117.7 12.99,116.92 16.28,109.61 16.8,109.09 18.9,108.69 27.94,100.43 IC19.24
BTN04
  TOP 0.152: CELL4.2 8.62,112.11 8.62,112.94 9.21,113.52 10.03,113.52 10.62,112.94 10.62,112.11 11.21,111.52 16.8,106.55 18.9,106.15 25.4,100.43 IC19.25
BTN05
  TOP 0.152: CELL5.2 7.19,105.94 11.07,106.3 12.17,106.3 12.22,106.28 16.66,103.66 20.91,102.03 21.03,101.98 22.86,100.43 IC19.26
BTN06
  TOP 0.152: CELL6.2 7.19,100.05 11.07,99.69 12.17,99.69 17.41,101.32 18.15,101.32 20.32,100.43 IC19.27
BTN07
  TOP 0.152: CELL7.2 7.19,98.32 11.07,98.68 17.78,99.21 IC19.28
BTN08
  BOTTOM 0.152: CELL8.2 7.19,94.51 8.05,94.51 12.05,94.51 17.78,92.81 IC19.1
BTN09
  BOTTOM 0.152: CELL9.2 7.19,88.62 9.07,88.27 11.07,88.27 12.17,88.27 16.2,89.8 18.3,90.35 20.32,91.59 IC19.2
BTN10
  BOTTOM 0.152: CELL10.2 7.19,86.89 12.24,87.91 16.31,89.46 18.37,89.99 20.69,90.7 22.86,91.59 IC19.3
BTN11
  BOTTOM 0.152: CELL11.2 8.62,85.44 8.62,86.27 9.21,86.85 12.32,87.55 16.42,89.12 16.65,89.18 23.23,90.7 25.4,91.59 IC19.4
BTN12
  BOTTOM 0.152: CELL12.2 7.19,79.27 12.05,81 12.66,81.61 14.24,86.49 14.48,87.07 14.56,87.21 15.81,88.46 15.95,88.54 16.53,88.78 16.69,88.82 25.77,90.7 27.94,91.59 IC19.5
BTN13
  BOTTOM 0.152: CELL13.2 8.62,77.82 8.62,78.65 9.21,79.23 12.22,80.66 13,81.44 13.02,81.49 14.58,86.38 14.8,86.91 14.85,86.99 16.03,88.18 16.11,88.22 16.64,88.44 16.73,88.47 28.31,90.7 30.48,91.59 IC19.6
BTN14
  BOTTOM 0.152: CELL14.2 8.62,74.01 8.62,74.84 9.21,75.42 12.05,77.19 12.66,77.8 14.92,86.27 15.12,86.75 15.13,86.77 16.25,87.89 16.27,87.91 16.75,88.11 16.78,88.11 30.85,90.7 33.02,91.59 IC19.7
BTN15
  BOTTOM 0.152: CELL15.2 6.62,70.2 6.62,71.03 7.21,71.61 10.03,73.42 10.62,74.01 10.62,74.84 13,77.63 13.02,77.68 15.27,86.18 15.42,86.56 16.46,87.6 16.84,87.76 33.39,90.7 35.56,91.59 IC19.8
BTN16
  TOP 0.152: CELL16.2 5.02,61.97 4.64,61.59 2.74,60.22 2.58,60.06 2.22,56.4 2.22,20.58 2.22,20.06 2.58,16.39 2.74,16.23 5.07,15.87 7.07,15.87 8.17,15.87 10.03,16.27 10.62,16.86 10.62,17.69 11.21,18.27 16.8,23.24 28.48,25.4 28.6,25.45 29.44,26.29 29.49,26.41 29.54,28.59 35.51,34.62 IC20.21
BTN17
  TOP 0.152: CELL17.2 2.74,56.41 2.58,56.25 2.58,20.44 2.58,20.2 2.74,20.04 4.5,18.31 4.66,18.15 4.66,17.92 4.65,17.77 4.62,17.69 4.62,16.86 5.21,16.27 7.21,16.27 8.03,16.27 8.62,16.86 8.62,17.69 9.21,18.27 12.05,20.04 16.66,23.6 28.4,25.76 29.13,26.48 29.18,28.73 32.97,34.62 IC20.22
BTN18
  TOP 0.152: CELL18.2 4.65,52.06 4.62,51.98 4.62,51.15 4.65,51.06 4.66,50.92 4.66,48.63 4.66,48.4 4.65,48.25 4.62,48.17 4.62,47.34 4.65,47.25 4.66,47.11 4.66,44.82 4.66,44.59 4.65,44.44 4.62,44.36 4.62,43.53 5.21,42.94 6.82,42.26 7,42.19 12.04,41.14 20.79,37.08 21.51,36.35 21.92,34.25 22.44,33.73 27.52,33.73 28.26,33.73 30.43,34.62 IC20.23
BTN19
  TOP 0.152: CELL19.2 6.62,48.17 6.62,47.34 7.21,46.75 9.19,46.71 11.19,46.71 12.05,46.71 16.8,51.18 17.54,51.18 18.76,51.18 19.28,50.66 19.28,49.92 18.76,49.4 16.66,49 12.42,46.07 12.24,46 9.21,44.94 8.62,44.36 8.62,43.53 9.21,42.94 12.29,42.11 25.72,36.73 27.89,35.84 IC20.24
BTN20
  TOP 0.152: CELL20.2 6.62,44.36 6.62,43.53 7.21,42.94 12.23,41.79 12.36,41.73 25.35,35.84 IC20.25
BTN21
  TOP 0.152: CELL21.2 7.02,42.56 7.07,42.55 12.16,41.46 12.18,41.45 12.2,41.44 20.98,37.39 22.81,35.84 IC20.26
BTN22
  TOP 0.152: CELL22.2 7.19,39.09 11.07,38.73 13.74,38.59 20.27,35.84 IC20.27
BTN23
  TOP 0.152: CELL23.2 7.19,37.36 9.07,37.72 11,38.08 13.07,38.23 13.59,38.23 17.73,35.84 IC20.28
BTN24
  TOP 0.152: CELL24.2 7.19,31.47 17.73,28.22 IC20.1
BTN25
  TOP 0.152: CELL25.2 7.19,27.66 17.36,26.11 18.1,26.11 20.27,27 IC20.2
BTN26
  TOP 0.152: CELL26.2 7.19,23.85 11.19,23.85 12.05,23.85 16.35,25.01 20.64,26.11 22.81,27 IC20.3
BTN27
  TOP 0.152: CELL27.2 7.19,22.12 16.43,24.66 23.18,26.11 25.35,27 IC20.4
BTN28
  TOP 0.152: CELL28.2 8.62,20.67 8.62,21.5 9.21,22.08 16.51,24.31 25.72,26.11 27.89,27 IC20.5
BTN29
  TOP 0.152: CELL29.2 7.19,12.42 11.19,12.42 12.05,12.42 12.66,13.03 16.28,20.18 16.8,20.7 24.27,23.6 28.55,25.04 28.8,25.15 29.74,26.08 30.43,27 IC20.6
BTN30
  TOP 0.152: CELL30.2 7.19,10.69 12.17,12.06 12.22,12.08 13,12.86 16.28,17.64 16.8,18.16 18.76,18.92 24.42,23.24 28.62,24.69 29.01,24.85 32.97,27 IC20.7
BTN31
  TOP 0.152: CELL31.2 7.19,6.88 10.03,8.65 10.62,9.24 10.62,10.07 11.21,10.65 16.8,15.62 18.76,16.38 24.42,20.7 26.38,21.46 29.88,23.92 35.51,27 IC20.8
BTN32
  TOP 0.152: CELL32.2 33.45,117.38 33.88,117.14 34.7,117.14 34.79,117.18 34.94,117.18 35.17,117.18 35.33,117.02 36.7,115.12 37.07,114.75 48.2,112.7 52.91,108.46 53.45,107.91 53.47,107.01 53.47,105.54 53.67,97.96 54.38,95.64 54.9,95.12 57.08,95.07 62.89,93.47 IC21.21
BTN33
  TOP 0.152: CELL33.2 35.31,117.54 35.69,117.17 37.06,115.26 37.22,115.1 48.34,113.06 53.04,108.79 53.78,108.05 53.79,107.14 53.79,105.6 54.03,98.04 54.76,97.31 62.89,96.01 IC21.22
BTN34
  TOP 0.152: CELL34.2 40.87,115.26 41.03,115.1 48.42,113.41 48.54,113.36 53.23,109.07 54.06,108.23 54.11,108.12 54.11,106.93 54.1,106.66 54.1,105.69 54.38,98.18 54.9,97.66 56.12,97.66 56.86,97.66 62.89,98.55 IC21.23
BTN35
  TOP 0.152: CELL35.2 45.22,117.18 45.31,117.14 46.13,117.14 46.22,117.18 46.37,117.18 46.6,117.18 46.76,117.02 48.13,115.12 54.34,108.42 54.44,108.18 54.44,106.87 54.42,106.52 54.42,105.82 54.92,105.32 56.86,104.52 62.89,101.09 IC21.24
BTN36
  TOP 0.152: CELL36.2 46.74,117.54 47.12,117.17 48.49,115.26 48.65,115.1 54.9,110.36 56.86,109.6 62.89,103.63 IC21.25
BTN37
  TOP 0.152: CELL37.2 52.84,117.18 52.93,117.14 53.75,117.14 53.84,117.18 53.99,117.18 54.22,117.18 54.38,117.02 55.75,115.12 62.89,106.17 IC21.26
BTN38
  TOP 0.152: CELL38.2 54.37,117.54 54.74,117.17 56.11,115.26 56.27,115.1 62.89,108.71 IC21.27
BTN39
  TOP 0.152: CELL39.2 58.19,117.02 62.89,111.25 IC21.28
BTN40
  BOTTOM 0.152: CELL40.2 62,117.02 62,115.5 62,115.26 61.84,115.1 56.49,111.25 IC21.1
BTN41
  TOP 0.152: CELL41.2 65.81,117.02 65.81,115.5 65.81,115.26 65.51,105.62 65,103.26 64.48,102.74 63.74,102.74 62.52,102.74 56.49,108.71 IC21.2
BTN42
  TOP 0.152: CELL42.2 67.56,117.54 67.18,117.17 67.18,115.64 67.18,115.12 67.34,108.86 67.69,107.15 67.69,106.63 67.19,105.84 65.35,103.12 64.62,102.39 63.59,102.39 62.38,102.39 56.49,106.17 IC21.3
BTN43
  TOP 0.152: CELL43.2 69.08,117.18 68.99,117.14 68.17,117.14 68.08,117.18 67.93,117.18 67.7,117.18 67.54,117.02 67.54,115.5 67.54,115.26 67.69,109 68.05,107.29 68.05,106.48 65,100.72 64.48,100.2 63.74,100.2 62.52,100.2 56.49,103.63 IC21.4
BTN44
  TOP 0.152: CELL44.2 77.23,117.54 77.6,117.17 77.6,115.64 77.6,115.12 77.23,114.75 73.29,111.48 72.77,110.96 72.37,108.86 69.47,101.38 68.95,100.86 64.62,99.85 63.59,99.85 62.38,99.85 56.49,101.09 IC21.5
BTN45
  TOP 0.152: CELL45.2 78.97,117.02 77.85,110.96 77.09,101.38 76.57,100.86 64.7,99.49 62.52,99.44 56.49,98.55 IC21.6
BTN46
  TOP 0.152: CELL46.2 82.78,117.02 80.39,110.96 80.39,109.74 80.39,109 82.17,103.34 82.17,102.12 82.17,101.38 81.65,100.86 64.48,95.12 63.74,95.12 62.52,95.12 56.49,96.01 IC21.7
BTN47
  BOTTOM 0.152: CELL47.2 86.59,119.71 84.82,122.56 84.23,123.14 61.37,123.14 60.55,123.14 59.96,122.56 59.96,120.56 59.96,119.73 60.55,119.14 61.37,119.14 61.96,118.56 62.36,117.17 62.36,115.64 62.36,115.12 61.04,112.17 60.94,111.92 59.16,104.56 57.38,95.64 56.49,93.47 IC21.8
BTN48  (via drill 0.4 pad 0.7)
  TOP 0.152: v35.58,65.59 35.85,64.25 36.04,63.78 37.76,61.89 38.13,61.52 38.65,61.52 40.35,61.98 40.54,62.06 41.47,62.99 41.98,62.99 42.34,62.63 45.1,59.38 53.11,49.92 53.63,49.4 55.59,48.64 61.62,45.21 IC22.21
  BOTTOM 0.152: CELL48.2 33.79,67.65 33.88,67.61 34.7,67.61 34.79,67.65 34.94,67.65 35.17,67.65 35.33,67.49 35.34,66.25 v35.58,65.59
BTN49
  TOP 0.152: CELL49.2 36.23,67.14 36.6,66.77 36.6,66.25 36.56,65.67 36.56,64.39 36.64,64.18 37.55,63.28 38.64,62.77 39.09,62.35 39.15,62.32 40.28,62.32 40.34,62.35 41.33,63.33 42.12,63.33 42.68,62.77 52.76,52.32 53.48,51.59 55.59,51.18 61.62,47.75 IC22.22
BTN50
  TOP 0.152: CELL50.2 37.06,67.49 36.95,66.1 36.91,65.6 36.91,64.46 36.94,64.38 37.74,63.58 38.79,63.11 39.26,62.66 40.17,62.66 41.18,63.67 41.19,63.67 42.26,63.67 43.01,62.92 53.11,52.46 53.63,51.94 55.73,51.54 61.62,50.29 IC22.23
BTN51
  TOP 0.152: CELL51.2 42.95,67.49 49.86,56.42 50.72,55.56 51.39,54.92 61.62,52.83 IC22.24
BTN52
  TOP 0.152: CELL52.2 46.76,67.49 50.15,56.65 50.16,56.62 50.92,55.86 51.54,55.28 52.06,55.28 53.63,56.26 54.37,56.26 55.59,56.26 61.62,55.37 IC22.25
BTN53
  TOP 0.152: CELL53.2 50.57,67.49 50.86,56.93 51.23,56.56 52.06,56.53 52.13,56.48 52.65,56.48 53.02,56.85 53.13,58.11 53.13,58.27 53.64,58.79 54.85,58.8 55.59,58.8 61.62,57.91 IC22.26
BTN54
  TOP 0.152: CELL54.2 52.3,67.49 52.3,65.97 52.3,65.73 52.49,61.46 52.86,61.09 53.38,61.09 53.63,61.34 54.37,61.34 55.59,61.34 61.62,60.45 IC22.27
BTN55
  TOP 0.152: CELL55.2 58.19,67.49 58.69,66.4 61.62,62.99 IC22.28
BTN56
  BOTTOM 0.152: CELL56.2 62,67.49 62,65.97 62,65.73 61.84,65.57 55.22,62.99 IC22.1
BTN57
  BOTTOM 0.152: CELL57.2 63.74,68.01 63.37,67.64 62.71,65.44 62.13,64.86 61.1,64.24 55.22,60.45 IC22.2
BTN58
  TOP 0.152: CELL58.2 67.54,67.49 66.52,65.44 65.46,63.51 64.75,61.12 63.73,57.54 63.21,57.02 62.47,57.02 61.25,57.02 55.22,57.91 IC22.3
BTN59
  TOP 0.152: CELL59.2 69.62,65.73 69.46,65.57 66.33,63.88 65.81,63.36 65.1,61.05 63.73,55 63.21,54.48 62.47,54.48 61.25,54.48 55.22,55.37 IC22.4
BTN60
  TOP 0.152: CELL60.2 73.43,65.73 73.27,65.57 68.29,62.1 66.19,61.7 65.46,60.97 63.73,52.46 63.21,51.94 62.47,51.94 61.25,51.94 55.22,52.83 IC22.5
BTN61
  BOTTOM 0.152: CELL61.2 78.97,67.49 76.43,62.62 75.91,62.1 73.73,62.05 73.61,62 72.77,61.17 69.16,54.86 68.44,54.13 66.19,54.08 63.21,51.94 61.1,51.54 55.22,50.29 IC22.6
BTN62
  BOTTOM 0.152: CELL62.2 82.8,68.01 82.42,67.64 81.05,65.73 80.89,65.57 78.89,64.24 76.06,61.75 73.81,61.7 73.08,60.97 69.47,54.66 68.63,53.82 68.51,53.77 66.33,53.72 63.35,51.59 61.25,51.18 55.22,47.75 IC22.7
BTN63
  BOTTOM 0.152: CELL63.2 84.32,67.65 84.23,67.61 83.41,67.61 83.32,67.65 83.17,67.65 82.94,67.65 82.78,67.49 81.41,65.59 81.04,65.22 79.03,63.88 76.25,61.44 76.13,61.39 73.95,61.34 73.43,60.82 68.81,52.46 68.29,51.94 66.33,51.18 63.21,49.4 61.25,48.64 55.22,45.21 IC22.8
BTN64
  BOTTOM 0.152: CELL64.2 33.88,19.54 34.7,19.54 37.69,21.54 38.51,21.54 39.1,22.13 41.48,26.63 41.88,28.73 42.61,29.46 51.12,33.73 51.64,34.25 52.05,35.72 52.76,38.11 53.48,38.84 55.59,39.24 60.91,41.68 61.03,41.73 63.21,41.78 63.73,42.3 66.7,47.75 IC23.21
BTN65
  BOTTOM 0.152: CELL65.2 37.69,19.54 38.51,19.54 39.1,20.13 41.83,26.48 42.24,28.59 42.76,29.11 51.27,33.38 51.99,34.1 52.4,35.65 53.11,37.96 53.63,38.48 55.73,38.89 61.1,41.38 63.35,41.43 64.08,42.16 66.7,45.21 IC23.22
BTN66
  BOTTOM 0.152: CELL66.2 39.14,18.11 40.87,22.97 44.02,26.63 44.78,28.59 45.3,29.11 51.66,32.77 52.6,33.7 52.7,33.96 53.11,35.42 53.63,35.94 55.59,36.7 60.91,39.14 61.03,39.19 63.21,39.24 66.7,42.67 IC23.23
BTN67
  BOTTOM 0.152: CELL67.2 42.95,18.11 44.72,20.96 45.31,21.54 46.13,21.54 46.72,22.13 49.1,26.63 49.86,28.59 50.38,29.11 53.63,30.86 61.1,33.76 63.21,34.16 63.73,34.68 66.7,40.13 IC23.24
BTN68
  BOTTOM 0.152: CELL68.2 46.76,18.11 48.49,22.97 49.1,23.58 61.25,33.4 63.35,33.81 64.08,34.54 66.7,37.59 IC23.25
BTN69
  BOTTOM 0.152: CELL69.2 52.93,19.54 53.75,19.54 56.74,21.54 57.56,21.54 58.15,22.13 63.73,29.6 66.7,35.05 IC23.26
BTN70
  BOTTOM 0.152: CELL70.2 56.74,19.54 57.56,19.54 58.15,20.13 59.58,23.14 66.7,32.51 IC23.27
BTN71
  BOTTOM 0.152: CELL71.2 58.19,18.11 59.92,22.97 66.7,29.97 IC23.28
BTN72
  BOTTOM 0.152: CELL72.2 64.27,15.58 64.36,15.54 65.18,15.54 65.27,15.58 65.42,15.58 65.65,15.58 67.93,15.58 68.08,15.58 68.17,15.54 68.99,15.54 69.58,16.13 71.35,22.97 74.32,29.97 IC23.1
BTN73
  BOTTOM 0.152: CELL73.2 65.81,18.11 67.58,20.96 68.17,21.54 68.99,21.54 69.58,22.13 73.08,30.49 74.32,32.51 IC23.2
BTN74
  BOTTOM 0.152: CELL74.2 69.62,18.11 70.99,23.09 73.43,30.34 73.95,30.86 75.89,31.67 76.38,32.16 76.38,32.86 75.54,35.05 IC23.3
BTN75
  BOTTOM 0.152: CELL75.2 73.43,18.11 75.2,20.96 75.79,21.54 76.61,21.54 77.2,22.13 77.2,22.96 76.42,29.14 76.42,30.81 76.69,32.03 76.69,32.99 76.42,34.22 76.42,35.42 75.54,37.59 IC23.4
BTN76
  BOTTOM 0.152: CELL76.2 77.24,18.11 77.93,21.92 77.93,23.16 77.12,29.24 77.12,30.7 77.32,31.88 77.32,33.14 77.12,34.32 77.12,35.64 76.78,38.11 75.54,40.13 IC23.5
BTN77
  BOTTOM 0.152: CELL77.2 81.01,18.13 81.01,18.96 80.42,19.54 79.6,19.54 79.01,20.13 78.28,21.92 78.28,23.23 77.47,29.31 77.47,30.63 77.62,31.82 77.62,33.2 77.47,34.39 77.47,35.71 77.14,38.19 76.43,40.5 75.54,42.67 IC23.6
BTN78
  BOTTOM 0.152: CELL78.2 82.78,18.11 81.01,20.96 80.42,21.54 79.6,21.54 79.01,22.13 78.98,23.35 78.17,29.46 78.17,30.48 78.25,31.71 78.25,33.31 78.17,34.54 78.17,35.84 77.85,38.33 76.78,43.19 75.54,45.21 IC23.7
BTN79
  BOTTOM 0.152: CELL79.2 89.01,17.94 89.03,17.99 89.03,19.1 88.67,22.97 88.06,23.58 79.04,29.09 78.52,29.61 78.52,30.34 78.56,31.67 78.56,33.35 78.52,34.69 78.52,35.89 78.21,38.39 77.14,43.27 76.43,45.58 75.54,47.75 IC23.8
BTN80
  BOTTOM 0.152: CELL80.2 96.09,124.99 97.97,125.35 99.9,125.7 101.14,125.7 113.97,125.13 123.05,123.93 123.77,123.2 124.81,121.35 124.99,120.91 128.04,107.07 128.93,104.9 IC24.21
BTN81
  TOP 0.152: CELL81.2 96.09,119.1 98.93,117.33 99.52,116.75 99.52,115.92 100.11,115.33 100.88,114.84 101.25,114.47 101.39,114.15 101.76,113.78 103.5,112.12 105.48,110.84 105.5,110.84 106.59,110.84 106.97,110.87 107.71,110.87 116.55,110.87 120.94,109.09 128.93,107.44 IC24.22
BTN82  (via drill 0.4 pad 0.7)
  TOP 0.152: v102.02,114.41 103.28,112.84 103.65,112.47 105.64,111.19 106.45,111.19 106.83,111.23 107.86,111.23 116.7,111.23 122.9,110.87 128.93,109.98 IC24.23
  BOTTOM 0.152: CELL82.2 96.09,115.29 100.88,114.84 v102.02,114.41
BTN83  (via drill 0.4 pad 0.7)
  TOP 0.152: v103.91,113.1 105.78,111.55 106.3,111.55 106.75,111.58 122.9,111.63 128.93,112.52 IC24.24
  BOTTOM 0.152: CELL83.2 96.09,111.48 100.09,111.48 100.95,111.48 v103.91,113.1
BTN84  (via drill 0.4 pad 0.7)
  TOP 0.152: v106.49,113.79 109.08,113.82 122.9,114.17 128.93,115.06 IC24.25
  BOTTOM 0.152: CELL84.2 95.92,110.09 95.97,110.11 101.07,111.12 101.12,111.14 104.17,112.47 105.48,113.5 105.5,113.52 v106.49,113.79
BTN85  (via drill 0.4 pad 0.7)
  TOP 0.152: v106.68,116.04 116.55,116.71 120.94,118.49 121.68,118.49 122.9,118.49 128.93,117.6 IC24.26
  BOTTOM 0.152: CELL85.2 95.52,108.3 95.52,109.13 96.11,109.71 97.97,110.11 101.14,110.77 101.32,110.84 104.31,112.12 105.64,113.16 106.75,113.17 106.98,113.4 111.58,114.03 111.74,114.2 111.74,114.43 111.74,115.93 111.58,116.09 110.28,116.09 110.04,116.09 v106.68,116.04
BTN86
  TOP 0.152: CELL86.2 93.55,104.41 93.52,104.49 93.52,105.32 93.55,105.4 93.56,105.55 93.56,105.78 93.56,108.07 93.55,108.22 93.52,108.3 93.52,109.13 93.55,109.21 93.56,109.36 93.56,109.59 93.56,111.88 93.55,112.03 93.52,112.11 93.52,112.94 93.55,113.02 93.56,113.17 93.56,113.4 93.56,115.69 93.55,115.84 93.52,115.92 93.52,116.75 93.55,116.83 93.56,116.98 93.56,117.21 93.56,119.5 93.55,119.65 93.52,119.73 93.52,120.56 94.11,121.14 97.97,121.54 99.07,121.54 101.07,121.54 106.73,121.01 108.92,121.01 114.45,118.9 115.66,118.9 116.7,118.9 122.9,119.25 128.93,120.14 IC24.27
BTN87
  TOP 0.152: CELL87.2 93.4,98.32 91.5,99.69 91.12,100.07 91.12,100.59 91.12,121.17 91.48,124.83 91.64,124.99 91.87,124.99 100.95,124.99 122.9,123.57 128.93,122.68 IC24.28
BTN88
  TOP 0.152: CELL88.2 95.52,96.87 95.52,97.7 94.93,98.28 91.64,100.05 91.48,100.21 91.48,100.45 91.48,121.02 91.64,121.18 93.97,121.54 97.9,121.9 99.14,121.9 101.14,121.9 106.8,121.34 109.05,121.34 114.59,119.25 115.81,119.25 116.55,119.25 121.31,122.68 IC24.1
BTN89
  BOTTOM 0.152: CELL89.2 96.11,86.12 96.93,86.12 97.52,86.71 97.52,87.54 98.11,88.12 106.97,95.63 110.04,95.77 110.28,95.77 111.58,95.77 111.74,95.61 111.78,81.18 111.94,81.01 113.24,81.01 113.48,81.01 116.55,81.15 117.07,81.67 118.14,94.08 119.91,118.16 119.93,118.2 121.31,120.14 IC24.2
BTN90  (via drill 0.4 pad 0.7)
  TOP 0.152: v106.04,112.18 105.88,113.54 105.88,114.05 106.24,114.41 106.75,114.41 106.98,114.19 107.4,114.17 108.19,114.17 108.93,114.17 114.59,115.95 116.7,116.36 121.31,117.6 IC24.3
  BOTTOM 0.152: CELL90.2 93.55,86.62 93.52,86.71 93.52,87.54 93.55,87.62 93.56,87.77 93.56,88 93.56,91.56 93.55,91.71 93.52,91.79 93.52,92.62 93.55,92.7 93.56,92.85 93.56,93.08 93.56,96.64 93.55,96.78 93.52,96.87 93.52,97.7 93.55,97.78 93.56,97.93 93.56,98.16 93.56,100.45 93.55,100.59 93.52,100.68 93.52,101.51 95.52,104.49 95.52,105.32 96.11,105.9 97.72,106.58 97.9,106.66 100.95,107.67 v106.04,112.18
BTN91
  BOTTOM 0.152: CELL91.2 95.52,72.3 95.52,66.39 96.11,65.8 97.51,65.15 98,65.15 101.07,65.41 101.12,65.42 101.9,66.2 109.37,77.27 110.13,78.03 110.16,78.05 116.84,80.09 117.1,80.19 118.03,81.13 123.42,89.29 123.93,104.35 123.93,105.46 123.93,108 123.91,108.04 123.13,108.82 123.08,108.84 120.94,109.09 120.42,109.61 120.42,110.35 120.42,112.89 121.31,115.06 IC24.4
BTN92
  BOTTOM 0.152: CELL92.2 93.55,67.3 93.52,67.22 93.52,66.39 94.11,65.8 95.72,65.12 95.9,65.05 97.24,64.5 98.27,64.5 101.22,64.69 101.52,64.82 102.5,65.8 110.07,76.97 110.44,77.33 117,79.38 117.48,79.58 117.51,79.59 118.63,80.72 124.08,88.95 124.13,89.07 124.64,104.21 124.64,105.6 124.64,108.14 124.51,108.44 122.53,112.52 IC24.5
BTN93
  BOTTOM 0.152: CELL93.2 95.92,65.42 95.97,65.41 97.37,64.83 98.14,64.83 101.14,65.05 101.32,65.12 102.2,66 109.71,77.11 110.29,77.69 116.92,79.73 117.3,79.89 118.33,80.92 123.77,89.15 124.28,104.28 124.28,105.53 124.28,108.07 124.21,108.24 122.53,109.98 IC24.6
BTN94  (via drill 0.4 pad 0.7)
  TOP 0.152: CELL94.2 97.15,66 97.52,66.39 97.52,67.22 98.11,67.8 100.69,70.14 101.12,70.5 v105.41,74.64
  BOTTOM 0.152: v105.41,74.64 109.73,78.64 110.02,78.76 116.7,80.8 117.42,81.53 120.07,102.88 120.42,105.27 121.31,107.44 IC24.7
BTN95  (via drill 0.4 pad 0.7)
  TOP 0.152: CELL95.2 95.52,61.31 95.52,62.14 v97.76,65.75
  BOTTOM 0.152: v97.76,65.75 100.95,65.76 101.56,66.37 109.07,77.47 109.93,78.34 110.09,78.4 116.77,80.44 116.89,80.49 117.73,81.33 117.78,81.45 120.42,102.73 121.31,104.9 IC24.8
BTN96
  TOP 0.152: IC25.21 80.62,47.75 88.61,49.4 93.4,50.52 CELL96.2
BTN97
  TOP 0.152: IC25.22 80.62,45.21 86.65,46.1 87.39,46.1 88.61,46.1 91.64,45.44 93.17,45.44 93.4,45.44 CELL97.2
BTN98
  TOP 0.152: IC25.23 80.62,42.67 86.65,41.78 87.87,41.78 88.61,41.78 91.64,42.44 91.87,42.44 93.4,42.44 CELL98.2
BTN99  (via drill 0.4 pad 0.7)
  TOP 0.152: IC25.24 80.62,40.13 86.65,39.24 v91.92,38.86
  BOTTOM 0.152: v91.92,38.86 93.55,37.72 93.92,37.35 CELL99.2
BTN100
  BOTTOM 0.152: IC25.25 80.62,37.59 86.65,34.16 88.76,33.76 93.55,32.64 93.92,32.27 CELL100.2
BTN101
  BOTTOM 0.152: IC25.26 80.62,35.05 86.51,33.81 88.61,33.4 93.4,32.28 93.56,32.12 93.56,31.89 93.55,31.74 93.52,31.66 93.52,30.83 93.55,30.74 CELL101.2
BTN102
  BOTTOM 0.152: IC25.27 80.62,32.51 89.31,23.34 91.48,20.2 91.64,20.04 93.17,20.04 93.4,20.04 CELL102.2
BTN103
  BOTTOM 0.152: IC25.28 80.62,29.97 88.23,23.92 89.01,23.14 91.12,20.06 93.92,17.03 CELL103.2
BTN_INT  (via drill 0.4 pad 0.7)
  TOP 0.152: U1.4 119.83,15.7 118.82,15.7 118.75,15.72 117.96,16.52 116.15,20.33 115.43,21.06 113.32,21.46 112.8,21.98 108.18,30.34 107.66,30.86 105.7,31.62 105.18,32.14 104.69,34.5 104.69,35.6 105.2,40.35 105.2,40.49 106.69,42.25 106.69,42.28 106.69,42.36 R1.1 | IC25.20 79.4,50.29 76.06,51.54 74.84,51.54 73.81,51.54 67.92,50.29 IC23.20 | IC21.20 62.89,90.93 56.86,94.36 54.68,94.41 v45.24,98.11
  BOTTOM 0.152: IC23.20 66.7,50.29 62.84,42.67 IC22.20 61.62,42.67 53.63,41.02 47.38,38.86 40.22,36.73 38.05,35.84 IC20.20 | U1.4 119.83,8.43 113.32,8 107.66,6.22 106.92,6.22 105.7,6.22 105.18,6.74 105.18,7.48 105.7,8 107.88,8.05 108,8.1 108.84,8.94 108.89,9.06 108.89,10.25 108.84,10.37 108,11.2 107.88,11.25 105.7,11.3 105.18,11.82 105.18,12.56 105.7,13.08 107.66,13.84 108.18,14.36 108.18,15.1 107.66,15.62 105.57,15.63 | v45.24,98.11 40.27,98.32 38.1,99.21 IC19.20 | IC21.20 64.11,90.93 72.57,93.31 73.48,93.31 74.13,92.66 74.13,91.74 72.01,84.87 71.49,84.35 62.52,84.2 62,83.68 62,82.94 62.52,82.42 67.71,82.06 84.69,82.02 84.85,81.86 84.85,80.56 84.85,80.33 84.71,77.25 84.61,77.14 84.61,76.33 85.2,75.21 85.22,75.17 85.88,71.99 85.95,71.81 86.63,70.2 87.22,69.61 88.04,69.61 88.63,69.03 88.67,67.49 88.67,65.96 88.67,65.74 88.51,65.57 86.51,64.24 85.78,63.51 85.07,61.12 84.56,58.68 84.49,52.47 | IC24.20 128.93,102.36 128.04,100.19 128.04,90.03 128.04,89.29 129.67,83.87 129.87,40.83 129.87,25.59 129.87,23.94 129.51,13.83 128.45,6.42 128.42,6.36 127.63,5.56 127.56,5.54 107.88,5.51 106.7,5.51 105.48,5.51 105.36,5.56 104.52,6.4 104.47,6.52 104.47,7.71 104.52,7.83 105.36,8.66 105.48,8.71 107.66,8.76 108.18,9.28 108.18,10.02 107.66,10.54 105.48,10.59 105.36,10.64 104.52,11.48 104.47,11.6 104.47,12.79 105.18,15.1 105.57,15.63 | 84.49,52.47 80.62,50.29 IC25.20 | 84.49,52.47 86.31,51.28 86.43,51.23 88.61,51.18 89.13,50.66 89.19,44.94 89.19,44.93 90.41,40.1 90.42,40.07 91.29,38.6 91.66,38.23 93.4,37.36 93.56,37.2 93.56,36.97 93.55,36.82 93.52,36.74 93.52,35.91 94.11,35.32 97.83,34.21 99.75,33.86 101.29,33.86 101.72,34.04 102.65,34.79 103.41,34.79 103.94,34.25 104.01,33.39 104.01,31.83 104.12,24.23 104.47,19.22 104.57,17.99 104.83,16.76 105.57,15.63
CS_IO
  TOP 0.152: IC24.11 122.53,97.28 123.91,99.22 123.93,99.27 123.93,100.38 123.42,102.73 122.9,103.25 120.94,104.01 116.55,108.33 115.33,108.33 114.59,108.33 114.07,107.81 113.72,105.42 113.72,85.1 113.72,84.07 114.45,83.34 116.7,83.29 117.42,82.56 120.93,76.61 122.27,71.95 122.35,71.02 122.36,71 122.59,70.72 122.59,70.2 117.93,40.57 117.93,39.44 117.96,39.38 U1.16 | 57.62,86.53 56.49,85.85 IC21.11 | IC23.11 75.54,55.37 79.03,54.48 80.25,54.48 80.99,54.48 87.02,55.37 IC25.11 88.24,55.37 93.56,60.84 93.56,61.08 93.55,61.23 93.52,61.31 93.52,62.14 93.55,62.22 93.56,62.37 93.56,62.6 93.56,66.16 93.55,66.31 93.52,66.39 93.52,67.22 93.55,67.3 93.56,67.45 93.56,67.68 93.56,71.24 93.55,71.38 93.52,71.47 93.52,72.3 93.55,72.38 93.56,72.53 93.56,72.76 91.08,76.69 90.22,77.55 87.07,80.39 86.95,80.44 62.52,84.96 57.62,86.53 | IC19.11 43.18,92.81 45.35,93.7 47.74,94.06 48.78,94.06 49.51,93.33 49.55,91.08 50.28,90.35 57.01,89.64 57.73,88.91 57.73,87.88 57.62,86.53
  BOTTOM 0.152: IC20.11 43.13,28.22 45.15,29.46 51.46,33.07 52.3,33.91 52.35,34.03 52.76,35.57 54,37.59 IC22.11 55.22,37.59 61.25,41.02 63.43,41.07 63.55,41.12 66.33,43.56 68.29,44.32 68.81,44.84 72.77,53.55 74.32,55.37 IC23.11 | IC25.11 88.24,55.37 89.92,53.63 90.84,51.66 91.05,51.16 91.06,51.11 91.12,45.46 91.5,45.08 107.84,41.53 107.89,41.51 108.67,40.73 113.69,32.51 IC18.11 114.91,32.51 U1.16
GND  (via drill 0.4 pad 0.7)
  TOP 0.254: CELL9.5 CELL10.5 | R4.2 42.79,58.31 38.24,58.31 C3.1 36.69,57.62 36.69,57.44 34.3,53.96 34.3,53.39 34.55,52.98 34.56,52.94 34.56,51.83 34.16,48.95 IC7.14 | IC21.10 55.27,88.39 53.98,86.39 53.98,86.38 53.98,85.32 53.98,85.31 54.73,84.56 54.74,84.56 56.88,84.25 62.89,83.31 IC21.17 | CELL33.5 CELL32.5 | IC19.16 IC19.17 | CELL61.5 CELL62.5 CELL63.5 | 4.49,80.68 2.72,79.32 2.53,79.13 2.53,77.33 2.72,77.14 10.07,75.51 CELL13.5 | CELL23.5 CELL24.5 | CELL31.5 CELL30.5 | CELL29.5 CELL28.5 | CELL2.5 CELL3.5 | CELL5.5 CELL6.5 | 4.49,80.68 10.07,79.32 CELL12.5 17.19,76.89 19.18,76.89 25.2,80.37 IC2.14 | C1.1 38.86,85.79 38.3,85.83 38.17,85.83 IC13.1 | CELL50.5 CELL49.5 | CELL59.5 CELL60.5 | IC12.14 116.18,94.74 119.83,96.63 | IC26.14 81.28,11.53 81.1,14.17 81.1,20.99 CELL77.5 CELL76.5 | IC24.15 128.93,89.66 126.85,89.66 | JP2.4 124.14,56.01 124.14,55.88 123.37,54.55 123.37,53.65 123.92,43.62 123.92,43.45 C6.1 125.26,41.9 125.26,41.72 125.5,31.81 125.86,29.37 126.53,28.7 127.47,28.45 128.14,27.78 128.14,26.83 U1.8 | JP3.3 126.85,89.66 | CELL65.5 CELL64.5 26.01,17.27 IC4.14 | CELL103.5 99.94,15.37 99.15,14.58 99.08,14.55 96.68,13.89 96.64,13.87 93.98,11.53 IC26.9 | IC20.15 50.75,35.84 48.6,36.78 47.82,36.78 45.67,35.84 | IC20.10 40.59,27 CELL67.5 CELL66.5 | IC7.9 46.86,47.73 45.92,41.72 45.67,35.84 | 45.67,35.84 IC20.17 | CELL11.5 10.07,83.13 2.72,83.13 2.53,82.94 2.53,81.14 2.72,80.95 4.49,80.68 | CELL8.5 CELL7.5 | CELL75.5 CELL74.5 | 38.91,85.78 40.74,85.28 44.71,85.97 44.89,85.97 R3.2 46.24,85.97 46.24,85.79 47.74,83.38 47.74,83.2 R2.2 47.74,81.65 47.74,81.47 46.26,78.8 46.26,78.62 C2.1 45.72,77.08 CELL52.5
  TOP 0.254: CELL71.5 CELL72.5 61.62,29.97 IC22.15 | ISP.6 84.21,100.81 84.76,101.36 86.36,109.37 IC6.9 86.36,110.59 84.91,122.59 CELL46.5 | 119.83,96.63 120.74,95.95 120.77,95.94 123.15,95.94 123.56,95.53 126.85,89.66 | R6.2 113.58,63.56 113.4,63.56 112.75,63.6 112.73,63.61 112.33,64 110.87,64.53 110.47,64.93 109.98,66.12 109.98,66.68 109.99,66.7 110.01,66.85 110.01,67.03 IC16.1 110.01,67.66 109.04,67.66 108.64,67.26 108.64,66.69 108.66,64.75 108.66,64.19 108.26,63.79 107.14,63.79 106.13,63.33 105.95,63.33 C5.1 104.61,61.79 104.43,61.79 v103.98,61.75 104.55,60.98 104.7,60.45 104.7,60.27 IC17.1 | CELL94.5 CELL95.5 98.97,55.55 88.24,52.83 IC25.10 87.02,52.83 81.01,53.77 79.01,53.77 75.54,52.83 IC23.10 74.32,52.83 67.92,60.45 IC23.16 | CELL58.5 CELL57.5 | CELL55.5 CELL54.5 | IC24.10 121.31,99.82 119.89,97.91 119.86,97.85 119.83,96.63 | CELL88.5 CELL89.5 | CELL91.5 CELL92.5 | CELL97.5 101.59,44.99 101.59,44.43 CELL98.5 | IC18.10 113.69,29.97 107.29,35.05 IC18.17 | CELL81.5 CELL82.5 | CELL99.5 100.21,34.69 100.21,33.06 CELL100.5 | CELL83.5 CELL84.5 CELL85.5